# Altium schematic sheet Power_Taghsim.SchDoc
size B
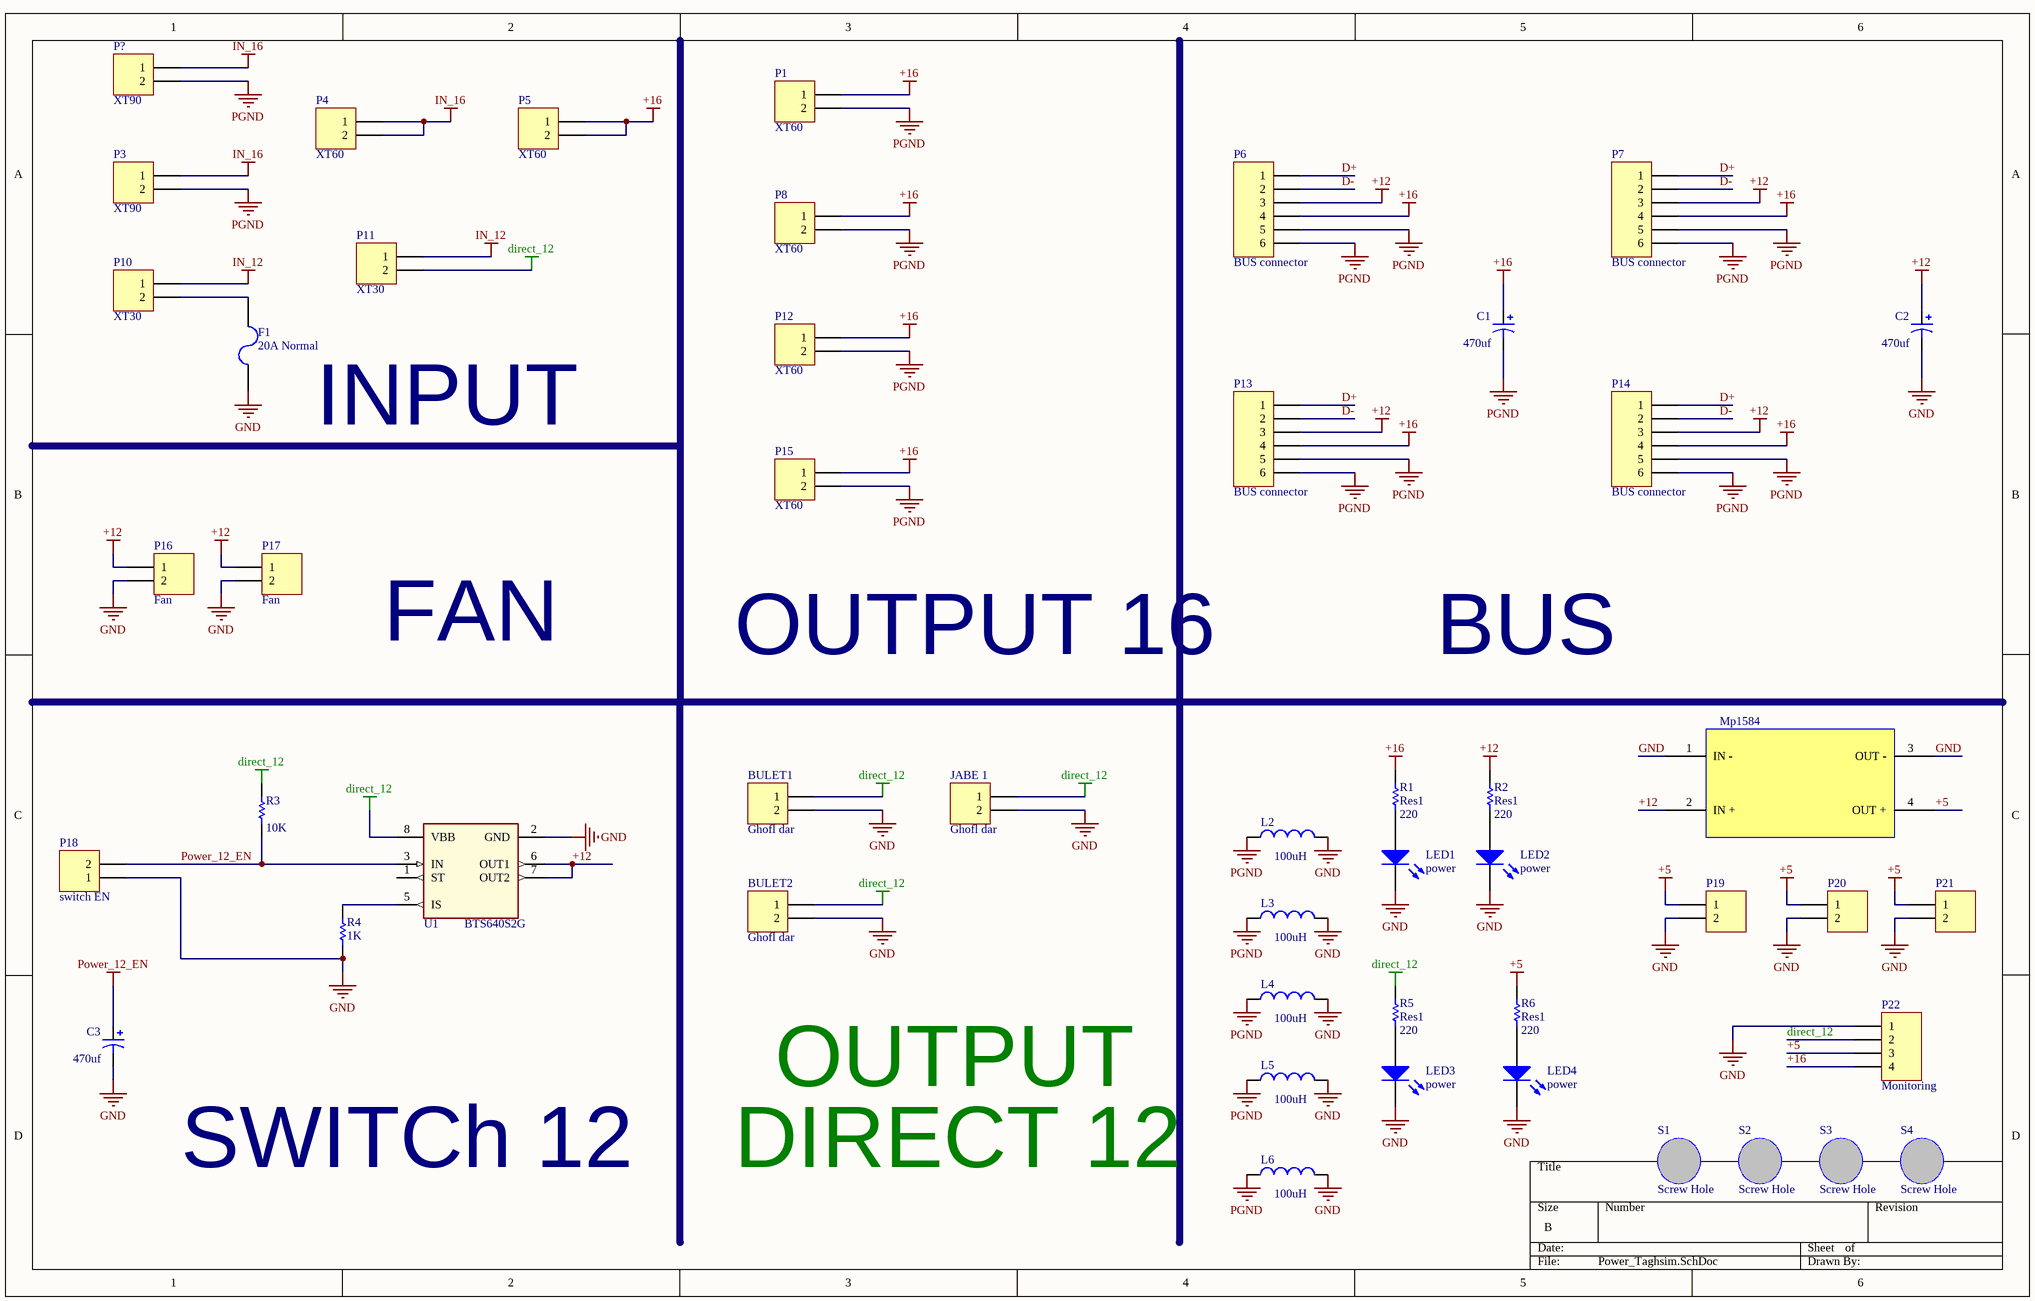
[diagram p0: Power_Taghsim.SchDoc]

## Parts
BULET1  Ghofl dar  [con2-tiwan]
BULET2  Ghofl dar  [con2-tiwan]
C1  value 470uf  [Cap Alireza montazeri]  (hidden comment: Cap Pol1)
C2  value 470uf  [Cap Alireza montazeri]  (hidden comment: Cap Pol1)
C3  value 470uf  [LED_3MM]  (hidden comment: Cap Pol1)
F1  20A Normal  [FUSE]
JABE_1  Ghofl dar  [con2-tiwan]
L2  value 100uH  [R3P]
L3  value 100uH  [R3P]
L4  value 100uH  [R3P]
L5  value 100uH  [R3P]
L6  value 100uH  [R3P]
LED1  power  [3518]
LED2  power  [3518]
LED3  power  [3518]
LED4  power  [3518]
Mp1  Mp1584  [MP1584_3A]
P1  XT60  [XT-60]
P3  XT90  [XT-90]
P4  XT60  [XT-60]
P5  XT60  [XT-60]
P6  BUS connector  [CON6-TIWAN]
P7  BUS connector  [CON6-TIWAN]
P8  XT60  [XT-60]
P10  XT30  [XT-30]
P11  XT30  [XT-30]
P12  XT60  [XT-60]
P13  BUS connector  [con6-tiwan]
P14  BUS connector  [con6-tiwan]
P15  XT60  [XT-60]
P16  Fan  [JP CIRCULAR 2]
P17  Fan  [JP CIRCULAR 2]
P18  switch EN  [jp circular 2]
P19  (no value)  [JP CIRCULAR 2]
P20  (no value)  [JP CIRCULAR 2]
P21  (no value)  [JP CIRCULAR 2]
P22  Monitoring  [JP CIRCULAR 4]
P?  XT90  [XT-90]
R1  Res1  value 220  [j1-0603]
R2  Res1  value 220  [j1-0603]
R3  value 10K  [j1-0603]
R4  value 1K  [j1-0603]  (hidden comment: Res1)
R5  Res1  value 220  [j1-0603]
R6  Res1  value 220  [j1-0603]
S1  Screw Hole  [Screw Holw 3-6 mm]
S2  Screw Hole  [Screw Holw 3-6 mm]
S3  Screw Hole  [Screw Holw 3-6 mm]
S4  Screw Hole  [Screw Holw 3-6 mm]
U1  BTS640S2G  [TO127P1490X440-8_7N]

## Nets
+5: Mp1.4(OUT_+) P19.1 P20.1 P21.1 P22.3 R6.1
+12: C2.1 Mp1.2(IN_+) P6.3 P7.3 P13.3 P14.3 P16.1 P17.1 R2.1 U1.6(OUT1) U1.7(OUT2)
+16: C1.1 P1.1 P5.1 P5.2 P6.4 P7.4 P8.1 P12.1 P13.4 P14.4 P15.1 P22.4 R1.1
direct_12: BULET1.1 BULET2.1 JABE_1.1 P11.2 P22.2 R3.1 R5.1 U1.8(VBB)
GND: BULET1.2 BULET2.2 C2.2 C3.2 F1.2 JABE_1.2 L2.2 L3.2 L4.2 L5.2 L6.2 LED1.2(K) LED2.2(K) LED3.2(K) LED4.2(K) Mp1.1(IN_-) Mp1.3(OUT_-) P16.2 P17.2 P18.1 P19.2 P20.2 P21.2 P22.1 R4.1 U1.2(GND)
IN_12: P10.1 P11.1
IN_16: P3.1 P4.1 P4.2 P?.1
PGND: C1.2 L2.1 L3.1 L4.1 L5.1 L6.1 P1.2 P3.2 P6.5 P6.6 P7.5 P7.6 P8.2 P12.2 P13.5 P13.6 P14.5 P14.6 P15.2 P?.2
Power_12_EN: C3.1 P18.2 R3.2 U1.3(IN)
D+: P6.1 P7.1 P13.1 P14.1
D-: P6.2 P7.2 P13.2 P14.2
NetF1_1: F1.1 P10.2
NetLED1_1: LED1.1(A) R1.2
NetLED2_1: LED2.1(A) R2.2
NetLED3_1: LED3.1(A) R5.2
NetLED4_1: LED4.1(A) R6.2
NetR4_2: R4.2 U1.5(IS)

Not connected (* = marked no-connect by the designer): U1 1(ST)

## Notes on the sheet
- INPUT
- FAN
- OUTPUT 16
- BUS
- OUTPUT
- SWITCh 12
- DIRECT 12

## Library data of the parts
BULET1 BULET2 JABE_1 P18 = Header 2: Header, 2-Pin; LatestRevisionDate: 17-Jul-2002; LatestRevisionNote: Re-released for DXP Platform.; Publisher: Altium Limited
C1-C3 = Cap Pol1: Polarized Capacitor (Radial); Published: 8-Jun-2000; LatestRevisionDate: 17-Jul-2002; LatestRevisionNote: Re-released for DXP Platform.; PackageReference: RB7.6-15; Publisher: Altium Limited
F1 = Fuse 2: Fuse; Manufacturer: Generic Components; Class: Passive; Published: 08/06/2000; Publisher: Altium Hobart Technology Centre; SubClass: Fuse
L2-L6 = Inductor: Manufacturer: Generic Components; Class: Passive; Published: 08/06/2000; Publisher: Altium Hobart Technology Centre; SubClass: Inductor
LED1-LED4 = LED3: Typical BLUE SiC LED; pin to pad: 1>2 2>1; Published: 8-Jun-2000; LatestRevisionDate: 17-Dec-2003; LatestRevisionNote: PCB Footprint replaced.; DatasheetDocument: 16-Apr-2002; PackageDocument: 16-Apr-2002; PackageReference: 3.5X2.8X1.9; Publisher: Altium Limited
P1 P3-P5 P8 P10-P12 P15 P? = Header 2: Header, 2-Pin; pin to pad: 1>+ 2>-; LatestRevisionDate: 17-Jul-2002; LatestRevisionNote: Re-released for DXP Platform.; Publisher: Altium Limited
P6 P7 P13 P14 = Header 6: Header, 6-Pin; LatestRevisionDate: 17-Jul-2002; LatestRevisionNote: Re-released for DXP Platform.; Publisher: Altium Limited
P16 P17 P19-P21 = Header 2: Header, 2-Pin; pin to pad: 1>2 2>1; LatestRevisionDate: 17-Jul-2002; LatestRevisionNote: Re-released for DXP Platform.; Publisher: Altium Limited
P22 = Header 4: Header, 4-Pin; LatestRevisionDate: 17-Jul-2002; LatestRevisionNote: Re-released for DXP Platform.; Publisher: Altium Limited
R1 R2 R4-R6 = Res1: Resistor; Published: 8-Jun-2000; LatestRevisionDate: 17-Jul-2002; LatestRevisionNote: Re-released for DXP Platform.; PackageReference: AXIAL-0.3; Publisher: Altium Limited
R3 = Res1: Resistor; Manufacturer: Generic Components; Class: Passive; Published: 08/06/2000; Publisher: Altium Hobart Technology Centre; SubClass: Resistor
U1 = BTS640S2G: Smart Sense High-Side Power Switch, VBB 43V, R(ON) 30mOhm; Manufacturer: Infineon Technologies; ManufacturerPartNumber: BTS640S2G; PackageReference: PG-TO263-7-2